# Altium project pwr_6.PrjPcb
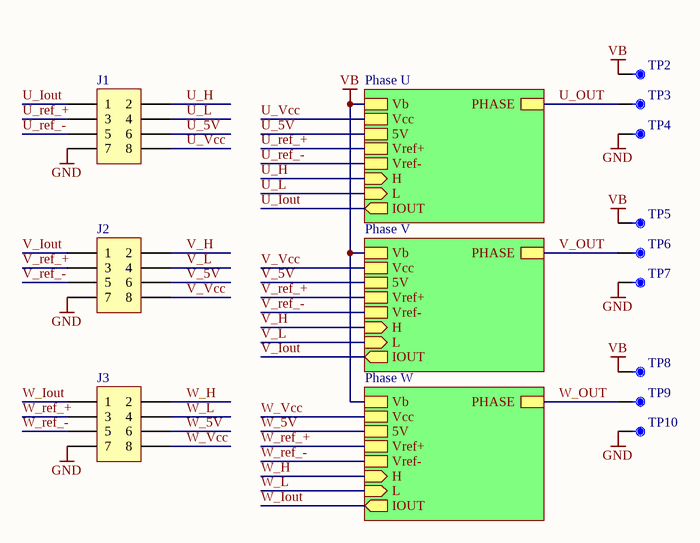
[diagram p0: main.SchDoc]
2 sheets, 114 parts. Net scope: hierarchical (ports join the sheet entries above them; power ports are global).
Board file: board.PcbDoc
Sheets:
  main.SchDoc
    Phase U = power_phase.schdoc
    Phase V = power_phase.schdoc
    Phase W = power_phase.schdoc

## Sheet main.SchDoc: Main
size A4; Revision: 1; SheetNumber: 1; SheetTotal: 2

### Parts
J1  (no value)  [HDR-SMD_8P-P2.54-V-M-R2-C4-LS8.0]
J2  (no value)  [HDR-SMD_8P-P2.54-V-M-R2-C4-LS8.0]
J3  (no value)  [HDR-SMD_8P-P2.54-V-M-R2-C4-LS8.0]
TP2  (no value)  [TP2030_SMD]  (no BOM)
TP3  (no value)  [TP2030_SMD]  (no BOM)
TP4  (no value)  [TP2030_SMD]  (no BOM)
TP5  (no value)  [TP2030_SMD]  (no BOM)
TP6  (no value)  [TP2030_SMD]  (no BOM)
TP7  (no value)  [TP2030_SMD]  (no BOM)
TP8  (no value)  [TP2030_SMD]  (no BOM)
TP9  (no value)  [TP2030_SMD]  (no BOM)
TP10  (no value)  [TP2030_SMD]  (no BOM)

### Sub-sheets
Phase U = power_phase.schdoc: PHASE, Vb, Vcc, IOUT (out), H (in), L (in), Vref+, Vref-, 5V
Phase V = power_phase.schdoc: PHASE, Vb, Vcc, IOUT (out), H (in), L (in), Vref+, Vref-, 5V
Phase W = power_phase.schdoc: PHASE, Vb, Vcc, IOUT (out), H (in), L (in), Vref+, Vref-, 5V

### Nets
GND: J1.7 J2.7 J3.7 TP4.1 TP7.1 TP10.1
VB: TP2.1 TP5.1 TP8.1 ; sheet Phase U/Vb, sheet Phase V/Vb, sheet Phase W/Vb
U_5V: J1.6 ; sheet Phase U/5V
U_H: J1.2 ; sheet Phase U/H
U_Iout: J1.1 ; sheet Phase U/IOUT
U_L: J1.4 ; sheet Phase U/L
U_OUT: TP3.1 ; sheet Phase U/PHASE
U_ref_+: J1.3 ; sheet Phase U/Vref+
U_ref_-: J1.5 ; sheet Phase U/Vref-
U_Vcc: J1.8 ; sheet Phase U/Vcc
V_5V: J2.6 ; sheet Phase V/5V
V_H: J2.2 ; sheet Phase V/H
V_Iout: J2.1 ; sheet Phase V/IOUT
V_L: J2.4 ; sheet Phase V/L
V_OUT: TP6.1 ; sheet Phase V/PHASE
V_ref_+: J2.3 ; sheet Phase V/Vref+
V_ref_-: J2.5 ; sheet Phase V/Vref-
V_Vcc: J2.8 ; sheet Phase V/Vcc
W_5V: J3.6 ; sheet Phase W/5V
W_H: J3.2 ; sheet Phase W/H
W_Iout: J3.1 ; sheet Phase W/IOUT
W_L: J3.4 ; sheet Phase W/L
W_OUT: TP9.1 ; sheet Phase W/PHASE
W_ref_+: J3.3 ; sheet Phase W/Vref+
W_ref_-: J3.5 ; sheet Phase W/Vref-
W_Vcc: J3.8 ; sheet Phase W/Vcc

### Library data of the parts
J1-J3 = Header 8
TP2-TP10 = TP_Dup1

## Sheet power_phase.schdoc: Phase
size A3; Revision: 1; SheetNumber: 2; SheetTotal: 2
Used 3 times, as channels Phase U, Phase V, Phase W. Parts and nets are listed once, with the designators drawn on the sheet.
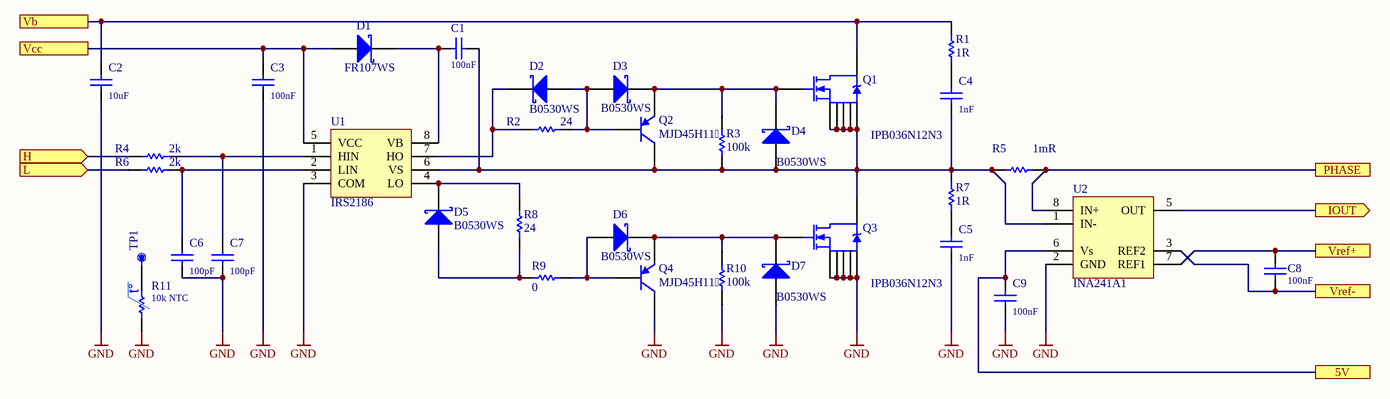
[diagram p1: power_phase.schdoc]

### Parts
C1  100nF  [C0805_L]
C2  10uF  [C2220]
C3  100nF  [C0603]
C4  1nF  [C0805]
C5  1nF  [C0805]
C6  100pF  [C0402]
C7  100pF  [C0402]
C8  100nF  [C0402]
C9  100nF  [C0402]
D1  FR107WS  [SOD-323]
D2  B0530WS  [SOD-323]
D3  B0530WS  [SOD-323]
D4  B0530WS  [SOD-323]
D5  B0530WS  [SOD-323]
D6  B0530WS  [SOD-323]
D7  B0530WS  [SOD-323]
Q1  IPB036N12N3  [TO-263-7]
Q2  MJD45H11  [TO-252AA]
Q3  IPB036N12N3  [TO-263-7]
Q4  MJD45H11  [TO-252AA]
R1  1R  [R1206]
R2  24  [R0603]
R3  100k  [R0805]
R4  2k  [R0603]
R5  1mR  [RES_CSS2H-3920R]
R6  2k  [R0603]
R7  1R  [R1206]
R8  24  [R0603]
R9  0  [R1206]
R10  100k  [R0805]
R11  10k NTC  [R0402]
TP1  (no value)  [TP2030_SMD]  (no BOM)
U1  IRS2186  [SO-8]
U2  INA241A1  [SOT-23-8]

### Ports
5V, H (in), IOUT (out), L (in), PHASE, Vb, Vcc, Vref+, Vref-

### Nets
GND: C2.1 C3.1 C5.1 C6.1 C7.1 C9.1 D7.1(A) Q3.2(S) Q3.3(S) Q3.5(S) Q3.6(S) Q3.7(S) Q4.2(C) R10.2 R11.2 U1.3(COM) U2.2(GND)
5V: C9.2 U2.6(Vs) ; port 5V
H: R4.2 ; port H
IOUT: U2.5(OUT) ; port IOUT
L: R6.2 ; port L
PHASE: R5.2 U2.8(IN+) ; port PHASE
Vb: C2.2 Q1.4(D) R1.2 ; port Vb
Vcc: C3.2 D1.1(A) U1.5(VCC) ; port Vcc
Vref+: C8.2 U2.7(REF1) ; port Vref+
Vref-: C8.1 U2.3(REF2) ; port Vref-
NetC1_1: C1.1 D1.2(K) U1.8(VB)
NetC1_2: C1.2 C4.1 D4.1(A) Q1.2(S) Q1.3(S) Q1.5(S) Q1.6(S) Q1.7(S) Q2.2(C) Q3.4(D) R3.2 R5.1 R7.2 U1.6(VS) U2.1(IN-)
NetC4_2: C4.2 R1.1
NetC5_2: C5.2 R7.1
NetC6_2: C6.2 R6.1 U1.2(LIN)
NetC7_2: C7.2 R4.1 U1.1(HIN)
NetD2_1: D2.1(A) D3.1(A) Q2.1(B) R2.1
NetD2_2: D2.2(K) R2.2 U1.7(HO)
NetD3_2: D3.2(K) D4.2(K) Q1.1(G) Q2.3(E) R3.1
NetD5_1: D5.1(A) R8.1 R9.2
NetD5_2: D5.2(K) R8.2 U1.4(LO)
NetD6_1: D6.1(A) Q4.1(B) R9.1
NetD6_2: D6.2(K) D7.2(K) Q3.1(G) Q4.3(E) R10.1
NetR11_1: R11.1 TP1.1

### Channels
Phase U: designators end in _1; ports 5V=U_5V H=U_H IOUT=U_Iout L=U_L PHASE=U_OUT Vb=VB Vcc=U_Vcc Vref+=U_ref_+ Vref-=U_ref_-
Phase V: designators end in _2; ports 5V=V_5V H=V_H IOUT=V_Iout L=V_L PHASE=V_OUT Vb=VB Vcc=V_Vcc Vref+=V_ref_+ Vref-=V_ref_-
Phase W: designators end in _3; ports 5V=W_5V H=W_H IOUT=W_Iout L=W_L PHASE=W_OUT Vb=VB Vcc=W_Vcc Vref+=W_ref_+ Vref-=W_ref_-

### Notes on the sheet
- (in symbol RES) t°

### Library data of the parts
C1 = CAP: 100n 0805
C2 = CAP: 10uF 100V 2220
C3 = CAP: 100n 0603
C4 C5 = CAP: 1nF 100V 0805
C6 C7 = CAP: 100pF 0402
C8 C9 = CAP: 100nF 0402
D1 = Diode 10TQ035_1
D2-D7 = Diode 10TQ035_1: FR107WS
Q1 Q3 = NMOS-2: IPB036N12N3GATMA1
Q2 Q4 = PNP
R1 R7 = Res1: 1R 1206
R2 R8 = Res1: 24R 0603
R3 R10 = Res1: 100k 0805
R4 R6 = Res1: 2k 0603
R5 = Res1
R9 = Res1: 0R 2512
R11 = RES
TP1 = TP_Dup1
U1 = IRS2186: IR2186

## Nets that join several sheets
GND: main (6 pins), Phase U (17 pins), Phase V (17 pins), Phase W (17 pins)
VB: main (TP2.1 TP5.1 TP8.1), Phase U (C2_1.2 Q1_1.4 R1_1.2), Phase V (C2_2.2 Q1_2.4 R1_2.2), Phase W (C2_3.2 Q1_3.4 R1_3.2)
U_5V: main (J1.6), Phase U (C9_1.2 U2_1.6)
U_H: main (J1.2), Phase U (R4_1.2)
U_Iout: main (J1.1), Phase U (U2_1.5)
U_L: main (J1.4), Phase U (R6_1.2)
U_OUT: main (TP3.1), Phase U (R5_1.2 U2_1.8)
U_ref_+: main (J1.3), Phase U (C8_1.2 U2_1.7)
U_ref_-: main (J1.5), Phase U (C8_1.1 U2_1.3)
U_Vcc: main (J1.8), Phase U (C3_1.2 D1_1.1 U1_1.5)
V_5V: main (J2.6), Phase V (C9_2.2 U2_2.6)
V_H: main (J2.2), Phase V (R4_2.2)
V_Iout: main (J2.1), Phase V (U2_2.5)
V_L: main (J2.4), Phase V (R6_2.2)
V_OUT: main (TP6.1), Phase V (R5_2.2 U2_2.8)
V_ref_+: main (J2.3), Phase V (C8_2.2 U2_2.7)
V_ref_-: main (J2.5), Phase V (C8_2.1 U2_2.3)
V_Vcc: main (J2.8), Phase V (C3_2.2 D1_2.1 U1_2.5)
W_5V: main (J3.6), Phase W (C9_3.2 U2_3.6)
W_H: main (J3.2), Phase W (R4_3.2)
W_Iout: main (J3.1), Phase W (U2_3.5)
W_L: main (J3.4), Phase W (R6_3.2)
W_OUT: main (TP9.1), Phase W (R5_3.2 U2_3.8)
W_ref_+: main (J3.3), Phase W (C8_3.2 U2_3.7)
W_ref_-: main (J3.5), Phase W (C8_3.1 U2_3.3)
W_Vcc: main (J3.8), Phase W (C3_3.2 D1_3.1 U1_3.5)